# EAGLE design AudioMega DIL-1206 TOP (EAGLE 6.3)
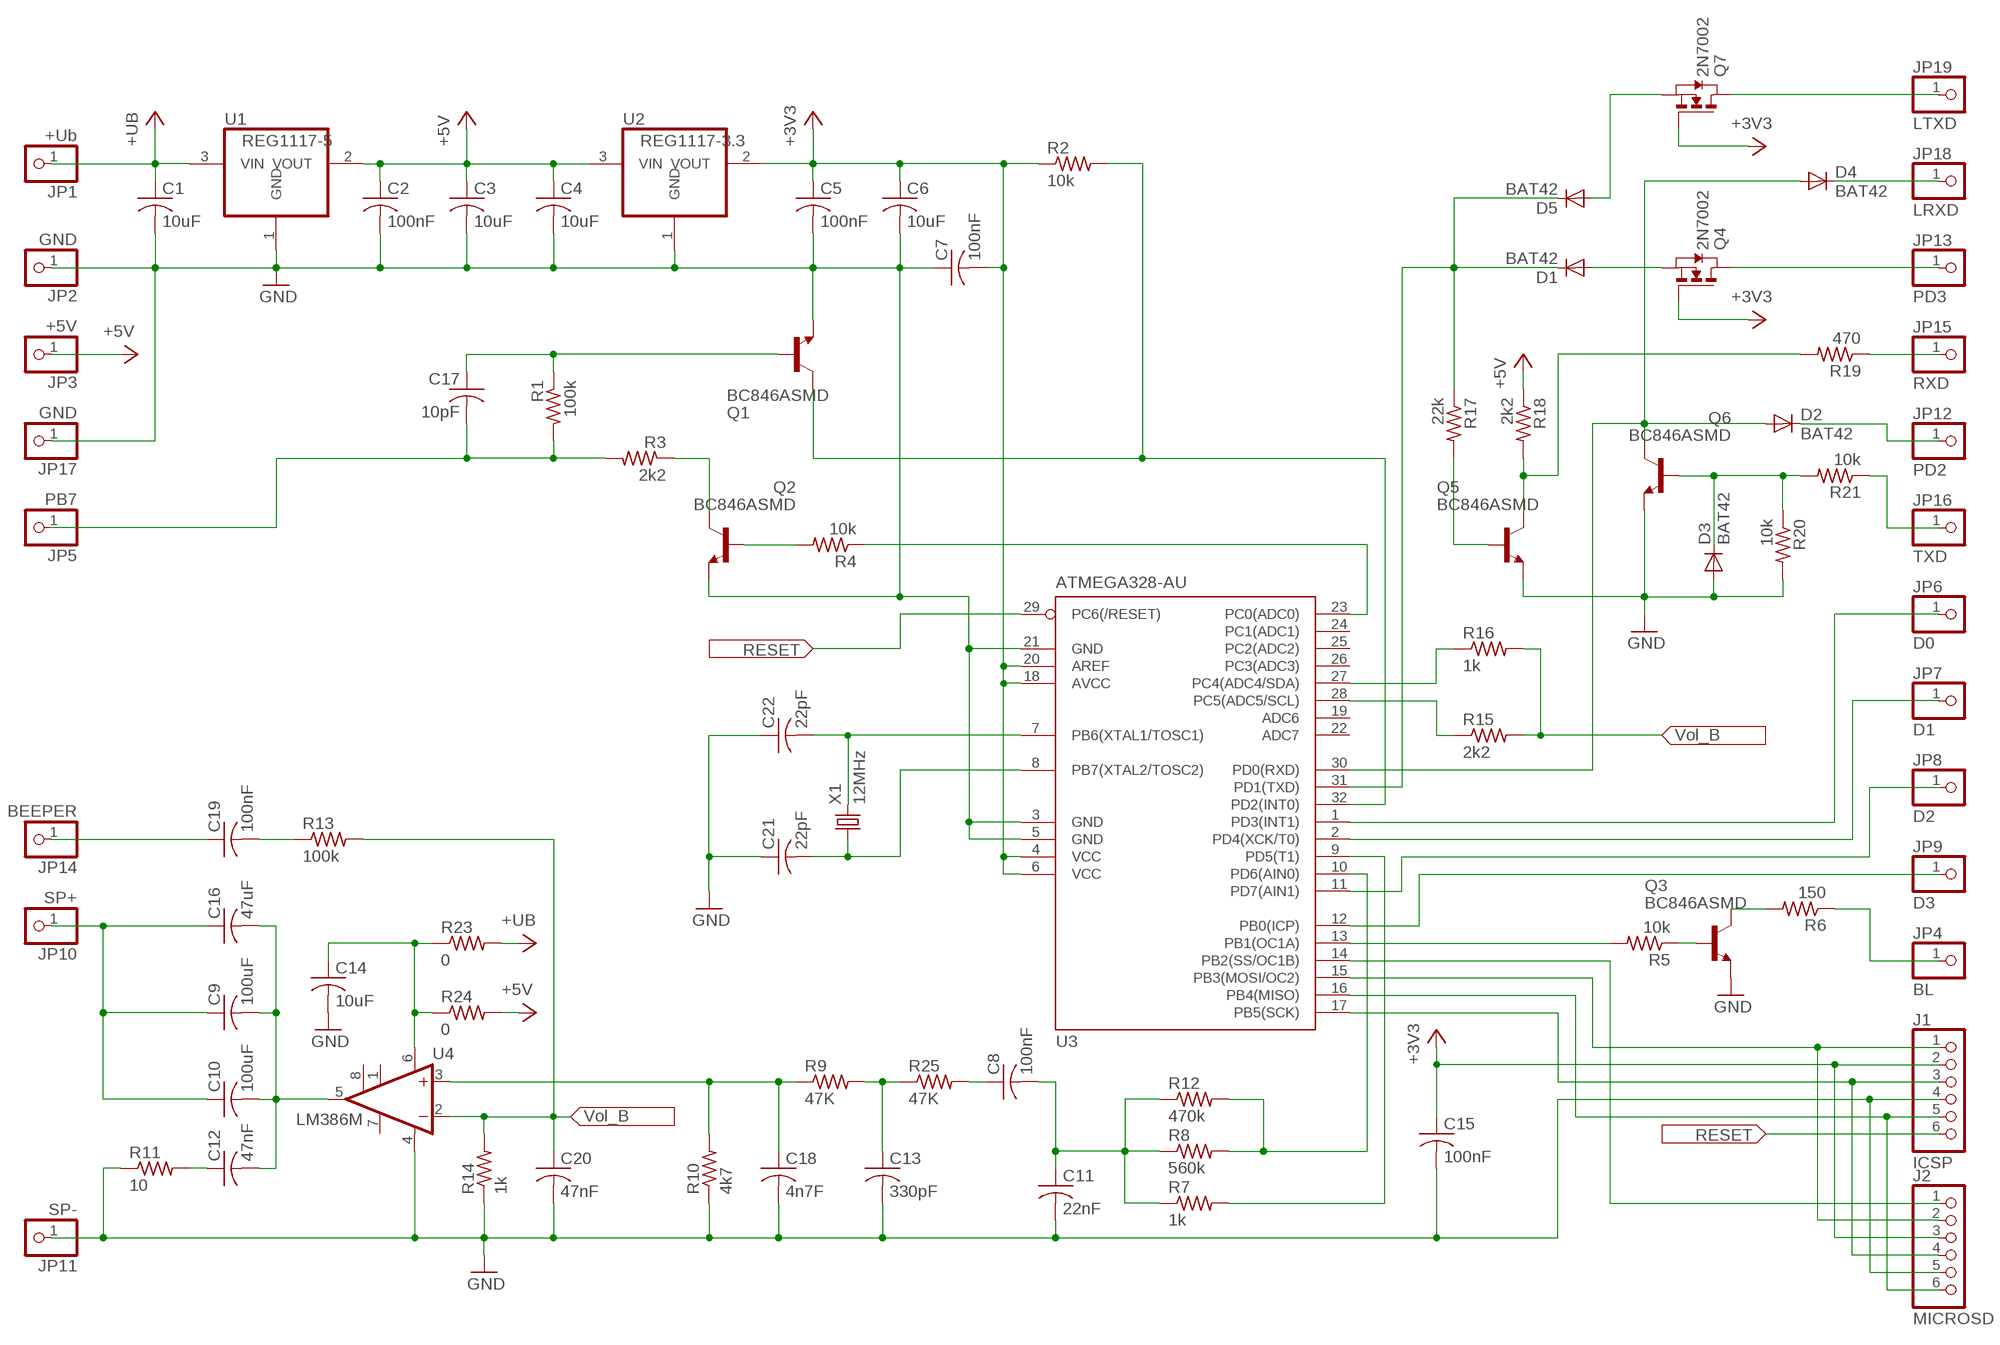
[diagram p0: schematic, sheet 1]

## Parts
C1  10uF  C-USC1206  [C1206]
C2  100nF  C-USC1206  [C1206]
C3  10uF  C-USC1206  [C1206]
C4  10uF  C-USC1206  [C1206]
C5  100nF  C-USC1206  [C1206]
C6  10uF  C-USC1206  [C1206]
C7  100nF  C-USC1206  [C1206]
C8  100nF  C-USC1206  [C1206]
C9  100uF  C-USC1206  [C1206]
C10  100uF  C-USC1206  [C1206]
C11  22nF  C-USC1206  [C1206]
C12  47nF  C-USC1206  [C1206]
C13  330pF  C-USC1206  [C1206]
C14  10uF  C-USC1206  [C1206]
C15  100nF  C-USC1206  [C1206]
C16  47uF  C-USC1206  [C1206]
C17  10pF  C-USC1206  [C1206]
C18  4n7F  C-USC1206  [C1206]
C19  100nF  C-USC1206  [C1206]
C20  47nF  C-USC1206  [C1206]
C21  22pF  C-USC1206  [C1206]
C22  22pF  C-USC1206  [C1206]
D1  BAT42  DIODE-SOD123  [SOD123]
D2  BAT42  DIODE-SOD123  [SOD123]
D3  BAT42  DIODE-SOD123  [SOD123]
D4  BAT42  DIODE-SOD123  [SOD123]
D5  BAT42  DIODE-SOD123  [SOD123]
J1  ICSP  PINHD-1X6  [1X06]
J2  MICROSD  PINHD-1X6  [1X06]
JP1  +Ub  PINHD-1X1  [1X01]
JP2  GND  PINHD-1X1  [1X01]
JP3  +5V  PINHD-1X1  [1X01]
JP4  BL  PINHD-1X1  [1X01]
JP5  PB7  PINHD-1X1  [1X01]
JP6  D0  PINHD-1X1  [1X01]
JP7  D1  PINHD-1X1  [1X01]
JP8  D2  PINHD-1X1  [1X01]
JP9  D3  PINHD-1X1  [1X01]
JP10  SP+  PINHD-1X1  [1X01]
JP11  SP-  PINHD-1X1  [1X01]
JP12  PD2  PINHD-1X1  [1X01]
JP13  PD3  PINHD-1X1  [1X01]
JP14  BEEPER  PINHD-1X1  [1X01]
JP15  RXD  PINHD-1X1  [1X01]
JP16  TXD  PINHD-1X1  [1X01]
JP17  GND  PINHD-1X1  [1X01]
JP18  LRXD  PINHD-1X1  [1X01]
JP19  LTXD  PINHD-1X1  [1X01]
Q1  BC846ASMD  [SOT23]
Q2  BC846ASMD  [SOT23]
Q3  BC846ASMD  [SOT23]
Q4  2N7002  NMOSSOT23  [SOT-23]
Q5  BC846ASMD  [SOT23]
Q6  BC846ASMD  [SOT23]
Q7  2N7002  NMOSSOT23  [SOT-23]
R1  100k  R-US_R1206  [R1206]
R2  10k  R-US_R1206  [R1206]
R3  2k2  R-US_R1206  [R1206]
R4  10k  R-US_R1206  [R1206]
R5  10k  R-US_R1206  [R1206]
R6  150  R-US_R1206  [R1206]
R7  1k  R-US_R1206  [R1206]
R8  560k  R-US_R1206  [R1206]
R9  47K  R-US_R1206  [R1206]
R10  4k7  R-US_R1206  [R1206]
R11  10  R-US_R1206  [R1206]
R12  470k  R-US_R1206  [R1206]
R13  100k  R-US_R1206  [R1206]
R14  1k  R-US_R1206  [R1206]
R15  2k2  R-US_R1206  [R1206]
R16  1k  R-US_R1206  [R1206]
R17  22k  R-US_R1206  [R1206]
R18  2k2  R-US_R1206  [R1206]
R19  470  R-US_R1206  [R1206]
R20  10k  R-US_R1206  [R1206]
R21  10k  R-US_R1206  [R1206]
R23  0  R-US_R1206  [R1206]
R24  0  R-US_R1206  [R1206]
R25  47K  R-US_R1206  [R1206]
U1  REG1117-5  REG1117  [SOT223]
U2  REG1117-3.3  REG1117  [SOT223]
U3  ATMEGA328-AU  MEGA8-AI  [TQFP32-08]
U4  LM386M  LM386M-1  [SO08]
X1  12MHz  CSM-3XHC49/US  [HC49US]

## Nets
+3V3: C5.1 C6.1 C7.2 C15.1 J1.2 J2.3 Q4.3(G) Q7.3(G) R2.1 U2.2(VOUT) U3.4(VCC) U3.6(VCC) U3.18(AVCC) U3.20(AREF)
+5V: C2.1 C3.1 C4.1 JP3.1 R18.1 R24.2 U1.2(VOUT) U2.3(VIN)
+UB: C1.1 JP1.1 R23.2 U1.3(VIN)
B7: C17.2 JP5.1 R1.2 R3.2
BACKLIGHT: JP4.1 R6.1
BEEPER: C19.1 JP14.1
CLK: Q1.3(C) R2.2 U3.32(PD2(INT0))
D0: JP6.1 U3.1(PD3(INT1))
D1: JP7.1 U3.2(PD4(XCK/T0))
D2: JP8.1 U3.11(PD7(AIN1))
D3: JP9.1 U3.12(PB0(ICP))
GND: C1.2 C2.2 C3.2 C4.2 C5.2 C6.2 C7.1 C11.2 C13.2 C14.2 C15.2 C18.2 C20.2 C21.1 C22.1 D3.A J1.4 J2.5 JP2.1 JP11.1 JP17.1 Q1.2(E) Q2.2(E) Q3.2(E) Q5.2(E) Q6.2(E) R10.1 R11.1 R14.1 R20.2 U1.1(GND) U2.1(GND) U3.3(GND) U3.5(GND) U3.21(GND) U4.4(GND)
MISO: J1.5 J2.6 U3.16(PB4(MISO))
MOSI: J1.1 J2.2 U3.15(PB3(MOSI/OC2))
N$1: R4.1 U3.23(PC0(ADC0))
N$2: C8.1 R25.2
N$3: D4.C JP18.1
N$4: JP19.1 Q7.1(D)
N$5: D5.A Q7.2(S)
N$7: C22.2 U3.7(PB6(XTAL1/TOSC1)) X1.2
N$8: C21.2 U3.8(PB7(XTAL2/TOSC2)) X1.1
N$9: Q2.1(B) R4.2
N$10: R16.1 U3.27(PC4(ADC4/SDA))
N$11: R15.1 U3.28(PC5(ADC5/SCL))
N$12: Q2.3(C) R3.1
N$13: C17.1 Q1.1(B) R1.1
N$16: C12.1 R11.2
N$17: C9.2 C10.2 C12.2 C16.2 U4.5(OUT)
N$18: C18.1 R9.1 R10.2 U4.3(+IN)
N$20: C19.2 R13.1
N$21: C14.1 R23.1 R24.1 U4.6(VS)
N$24: C13.1 R9.2 R25.1
N$25: C8.2 C11.1 R7.1 R8.1 R12.1
N$26: Q3.3(C) R6.2
N$27: R7.2 U3.9(PD5(T1))
N$28: R8.2 R12.2 U3.10(PD6(AIN0))
N$33: Q3.1(B) R5.1
N$34: R5.2 U3.13(PB1(OC1A))
N$40: D3.C Q6.1(B) R20.1 R21.2
N$42: D2.A D4.A Q6.3(C) U3.30(PD0(RXD))
N$43: Q5.3(C) R18.2 R19.2
N$44: Q5.1(B) R17.2
N$45: D1.A Q4.2(S)
N$46: D1.C D5.C R17.1 U3.31(PD1(TXD))
PB2: J2.1 U3.14(PB2(SS/OC1B))
PD2: D2.C JP12.1
PD3: JP13.1 Q4.1(D)
RESET: J1.6 U3.29(PC6(/RESET))
RXD: JP15.1 R19.1
SCK: J1.3 J2.4 U3.17(PB5(SCK))
SPEAKER+: C9.1 C10.1 C16.1 JP10.1
TXD: JP16.1 R21.1
VOL_B: C20.1 R13.2 R14.2 R15.2 R16.2 U4.2(-IN)
Unconnected: U3.19(ADC6) U3.22(ADC7) U3.24(PC1(ADC1)) U3.25(PC2(ADC2)) U3.26(PC3(ADC3)) U4.1(GAIN) U4.7(BYPASS) U4.8(GAIN)

## Library data of the parts
C1-C22 = resistor:C-US: CAPACITOR, American symbol
D1-D5 = diode:DIODE-: DIODE
J1 J2 = pinhead:PINHD-1X6: PIN HEADER
JP1-JP19 = pinhead:PINHD-1X1: PIN HEADER
Q1-Q3 Q5 Q6 = transistor-npn:BC846*: NPN Transistor
Q4 Q7 = zetex:NMOSSOT23: MOS FET; OC_FARNELL: unknown; OC_NEWARK: unknown
R1-R21 R25 = resistor:R-US_: RESISTOR, American symbol
R23 R24 = rcl:R-US_: RESISTOR, American symbol
U1 U2 = burr-brown:REG1117: 800mA and 1A Low Dropout (LDO) Positive Regulator 1.8V, 2.5V, 2.85V, 3.3V, 5V, and Adj; MPN: REG1117; OC_FARNELL: 1097566; OC_NEWARK: 14P6981
U3 = atmel:MEGA8: MICROCONTROLLER 8 Kbytes FLASH, 1 kbytes SRAM, 512 bytes EEPROM, USART, 6-channel 10 bit ADC, 2-channel 8 bit ADC Pin compatible with Atmega48, ATMega88, ATMega168 Source: avr.lbr; MPN: ATMEGA8-16AU; OC_FARNELL: 9171371; OC_NEWARK: 73M8863
U4 = linear:LM386?-*: Low Voltage Audio Power Amplifier Source: http://cache.national.com/ds/LM/LM386.pdf
X1 = jdc:CSM-3X

## Board
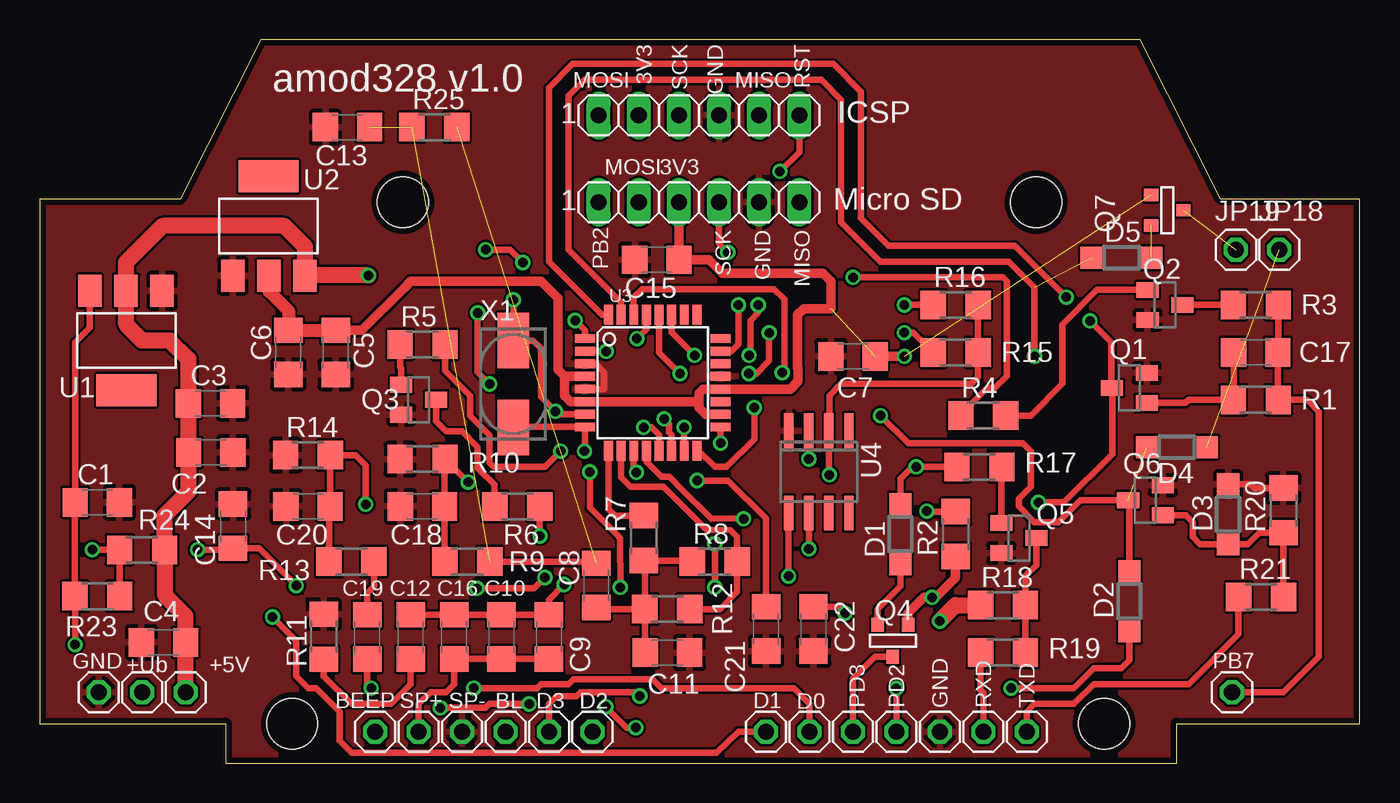
[diagram p1: board, top side]
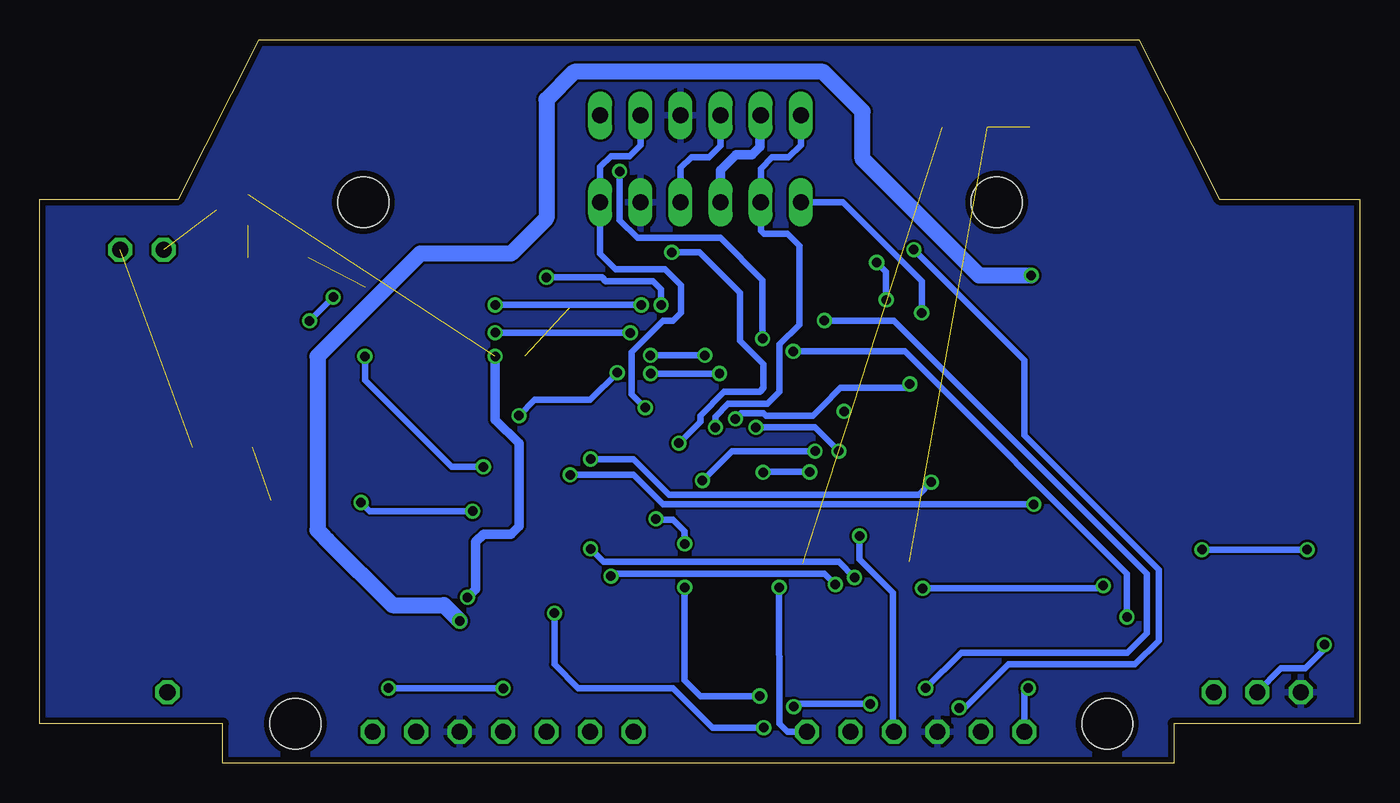
[diagram p2: board, bottom side, seen from below]

Size 83.6 x 45.8 mm. Coordinates in mm from the lower left corner, seen from the top.
Outline: 0,2.5 11.8,2.5 11.8,0 72,0 72,2.5 83.6,2.5 83.6,35.7 74.8,35.7 69.7,45.8 14,45.8 8.9,35.7 0,35.7 0,2.5
Copper layers (1*16): Top 0.0356mm / dielectric 1.5011mm / Bottom 0.0356mm
Design rules "LaenPCBOrder *": minimum track width 6mil, minimum drill 13mil, track to track 6mil, track to pad 6mil, pad to pad 6mil, via to via 6mil, smd to smd 6mil, copper to edge 15mil, drill to drill 6mil, minimum pad ring 7mil, minimum via ring 7mil, stop-mask expansion 4mil, vias tented up to drill 24mil, thermal gap 10mil
Holes 3.2 mm at 16,2.5 67.4,2.5 23,35.5 63.1,35.5

### Footprints (pad centres in the part's own frame; a part is rotated, then mirrored left to right if it is on the bottom)
C1206 = smd 1.6 x 1.8: 1 -1.4,0; 2 1.4,0
SOD123 = smd 1.4 x 1.4: A 1.9,0; C -1.9,0
1X06 = drill 1.016 long: 1 -6.35,0; 2 -3.81,0; 3 -1.27,0; 4 1.27,0; 5 3.81,0; 6 6.35,0
1X01 = drill 1.016 octagon: 1 0,0
SOT23 = smd 1 x 1.4: 1 -0.95,-1.1; 2 0.95,-1.1; 3 0,1.1
SOT-23 = smd 0.787 x 0.889: 1 0.025,-1.016; 2 -0.94,1.016; 3 0.991,1.016
R1206 = smd 1.6 x 1.803: 1 -1.422,0; 2 1.422,0
SOT223 = smd 1.499 x 2.007: 1 -2.261,-3.15; 2 0.025,-3.15; 3 2.311,-3.15 | smd 3.81 x 2.007: 4 0,3.15
TQFP32-08 = smd 1.27 x 0.559: 1 -4.293,2.8; 2 -4.293,2; 3 -4.293,1.2; 4 -4.293,0.4; 5 -4.293,-0.4; 6 -4.293,-1.2; 7 -4.293,-2; 8 -4.293,-2.8; 17 4.293,-2.8; 18 4.293,-2; 19 4.293,-1.2; 20 4.293,-0.4; 21 4.293,0.4; 22 4.293,1.2; 23 4.293,2; 24 4.293,2.8 | smd 0.559 x 1.27: 9 -2.8,-4.293; 10 -2,-4.293; 11 -1.2,-4.293; 12 -0.4,-4.293; 13 0.4,-4.293; 14 1.2,-4.293; 15 2,-4.293; 16 2.8,-4.293; 25 2.8,4.293; 26 2,4.293; 27 1.2,4.293; 28 0.4,4.293; 29 -0.4,4.293; 30 -1.2,4.293; 31 -2,4.293; 32 -2.8,4.293
SO08 = smd 0.6 x 2.2: 1 -1.905,-2.6; 2 -0.635,-2.6; 3 0.635,-2.6; 4 1.905,-2.6; 5 1.905,2.6; 6 0.635,2.6; 7 -0.635,2.6; 8 -1.905,2.6
HC49US = smd 3.5 x 2: 1 -2.75,0; 2 2.75,0

### Placement (x,y rotation side)
C1  3.66,16.51 0 top
C2  10.84,19.67 0 top
C3  10.83,22.77 0 top
C4  7.85,7.65 180 top
C5  18.75,26 270 top
C6  15.75,26 270 top
C7  51.5,25.75 0 top
C8  35.25,11.25 270 top
C9  32.25,8 90 top
C10  29.25,8 90 top
C11  39.75,7 0 top
C12  23.5,8 90 top
C13  19.5,40.25 180 top
C14  12.25,15 90 top
C15  39.09,31.86 180 top
C16  26.25,8 90 top
C17  77,26 0 top
C18  24.25,16.25 180 top
C19  20.75,8 90 top
C20  17,16.25 180 top
C21  46,8.5 90 top
C22  49,8.5 90 top
D1  54.5,14.5 270 top
D2  69,10.25 90 top
D3  75.25,15.75 90 top
D4  72,20 180 top
D5  68.5,32 0 top
J1  41.75,41 0 top
J2  41.75,35.5 0 top
JP1  6.5,4.5 0 top
JP2  3.75,4.5 0 top
JP3  9.25,4.5 0 top
JP4  29.5,2 0 top
JP5  75.5,4.5 0 top
JP6  48.75,2 0 top
JP7  46,2 0 top
JP8  35,2 0 top
JP9  32.25,2 0 top
JP10  24,2 0 top
JP11  26.75,2 0 top
JP12  54.25,2 0 top
JP13  51.5,2 0 top
JP14  21.25,2 0 top
JP15  59.75,2 0 top
JP16  62.5,2 0 top
JP17  57,2 0 top
JP18  78.5,32.5 0 top
JP19  75.75,32.5 0 top
Q1  69,23.75 90 top
Q2  71.25,29 270 top
Q3  24,23 270 top
Q4  54,7.75 0 top
Q5  62,14.25 270 top
Q6  70.02,16.64 90 top
Q7  71.39,34.97 90 top
R1  77,23 0 top
R2  58,14.5 90 top
R3  77,29 0 top
R4  59.75,22 0 top
R5  24.25,26.5 0 top
R6  30.25,16.25 180 top
R7  38.25,14.25 90 top
R8  42.75,12.75 0 top
R9  27.09,12.75 0 top
R10  24.25,19.25 0 top
R11  18,8 270 top
R12  39.75,9.75 0 top
R13  19.75,12.75 180 top
R14  17,19.5 0 top
R15  58,26 0 top
R16  58,29 0 top
R17  59.5,18.75 0 top
R18  61,10 0 top
R19  61,7 0 top
R20  78.75,16 90 top
R21  77.33,10.52 0 top
R23  3.66,10.57 180 top
R24  6.5,13.5 0 top
R25  25,40.25 0 top
U1  5.5,26.75 180 top
U2  14.5,34 0 top
U3  38.82,24.08 0 top
U4  49.34,18.44 180 top
X1  30,24 90 top

### Tracks (layer width: path | path; a pad name or v marks a point on that pad's centre or on a via)
+3V3  (via drill 0.6)  (3 unrouted)
  Top 0.406: 52.92,25.77 C7.2
  Top 0.61: C5.1 20.4,27.4 23.1,30.09 23.51,30.5 31.75,30.5 32.84,29.41 32.84,28.74 32.82,24.91 33.25,24.5 | 33.25,24.5 34.51,24.5 U3.4 | 33.25,24.5 33.25,23.25 33.62,22.88 U3.6 41.62,22.88 41.75,22.75 | 50.06,28.77 48.4,28.77 48,28.37 48,25 48.01,24.99 48.01,24.16 47.53,23.68 U3.20 42,23.67 41.75,23.42 41.75,22.75 | J2.3 C15.1 42.39,31.86 43.25,31 49.6,31 50.1,30.5 50.1,28.77 | Q4.3 54.99,9.49 56,10.5 v56.5,10.5 56.75,10.5 58,11.75 R2.1 | C7.2 v54.75,25.75 | U3.18 42.17,22.08 41.75,22.5 41.75,22.75
  Top 0.813: U2.2 14.53,29.86 15.76,28.63 C6.1 C5.1
  Bottom 0.61: J2.3 40.48,37.52 39.5,38.5 38.5,38.5 38,39 38,40.94 J1.2 | v54.75,25.75 54.75,21.75 53.25,20.25 53.25,15 53.75,14.5 55.5,14.5 56,14 56,11 v56.5,10.5
+5V  (via drill 0.6)
  Top 0.813: 16.83,30.87 U2.3
  Top 1.016: v20.81,30.87 16.83,30.87 | JP3.1 C4.1 9.25,9.31 7.96,10.6 7.96,13.46 R24.2 7.92,15.69 9.45,17.22 C2.1 C3.1 9.43,25.57 8.25,26.75 6.5,26.75 5.5,27.75 5.5,29.87 U1.2 5.47,31.68 7.79,34 15.5,34 16.81,32.69 U2.3 | v57,9 58,10 R18.1
  Bottom 1.016: v20.81,30.87 24.12,30.87 31.5,38.25 31.5,41.25 34,43.75 49.75,43.75 51.5,42 51.5,34.5 53.75,32.25 59.5,32.25 66,25.75 66,14.75 65.75,14.5 65.38,14.12 61.25,10 58,10 v57,9
+UB  (via drill 0.6)
  Top 0.406: v2.25,7.5 2.25,10.56 R23.2 2.24,16.49 C1.1 2.26,26.64 3.17,27.55 3.17,29.88 U1.3
  Bottom 0.406: JP1.1 5,6 3.45,6 2.25,7.2 v2.25,7.5
B7
  Top 0.406: R3.2 78.42,26.02 C17.2 78.4,23.02 R1.2 80.25,23 81,22.25 81,6.75 78.75,4.5 JP5.1
BACKLIGHT  (via drill 0.6)
  Top 0.406: R6.1 v31.67,14.39 v31.68,14.38
  Bottom 0.406: v31.68,14.38 31.68,12.91 29.56,10.79 29.56,2.06 JP4.1
BEEPER  (via drill 0.6)
  Top 0.406: C19.1 20.75,5 v21,4.75
  Bottom 0.406: v21,4.75 21.25,4.5 JP14.1
CLK  (via drill 0.6)
  Top 0.406: R2.2 56.2,15.92 v56.17,15.95 | v63.25,16.5 64.85,16.5 67.91,19.56 Q1.3 67.87,23.78 67.87,26.63 v66.5,28 | U3.32 35.63,28.37 32.25,31.75 32.25,42.75 33.75,44.25 50.25,44.25 52,42.5 52,34.5 53.75,32.75 61.75,32.75 v65,29.5
  Bottom 0.406: v56.17,15.95 62.7,15.95 v63.25,16.5 | v65,29.5 v66.5,28
D0  (via drill 0.6)
  Top 0.406: v27.5,4.75 31.5,4.75 31.75,5 33.5,5 33.81,5.31 38.82,5.31 39.38,4.75 47.75,4.75 48.75,3.75 JP6.1 | U3.1 34.53,27.4 v33.91,28.02
  Bottom 0.406: v27.5,4.75 25.25,7 14.73,7 13.5,8.23 13.5,12 29.5,28 33.89,28 v33.91,28.02
D1  (via drill 0.6)
  Top 0.406: JP7.1 44.25,2 42.87,0.67 19.75,0.67 19,1.42 19,3.25 17.5,4.75 17,4.75 16.25,5.5 16.25,7.75 v14.75,9.25 | v35.88,26.06 35.4,26.08 U3.2
  Bottom 0.406: v14.75,9.25 14.75,12 28.81,26.06 v35.88,26.06
D2  (via drill 0.6)
  Top 0.406: U3.11 37.62,18.58 v37.79,18.41 | v34.84,18.43 34.84,16.16 36.65,14.35 36.65,14.34 36.75,14.24 v36.77,11.13
  Bottom 0.406: v36.77,11.13 36.75,2.5 36.25,2 JP8.1 | v34.84,18.43 37.77,18.43 v37.79,18.41
D3  (via drill 0.6)
  Top 0.406: U3.12 38.42,19.08 39.38,18.12 39.88,18.12 40.75,17.25 42.3,15.73 42.55,15.48 44.54,15.5 v44.58,15.46 | v42.75,13.88 v42.75,11.13 | v38,4.25 37.75,4.5 34.25,4.5 34,4.25 32.75,4.25 32.25,3.75 JP9.1
  Bottom 0.406: v42.75,11.13 42.75,5.25 41.75,4.25 v38,4.25 | v42.75,13.88 42.75,14.69 43.48,15.42 44.54,15.42 v44.58,15.46
GND
  Top 0.406: 12.21,16.44 C14.2 | D3.A 76.7,17.65 76.95,17.4 78.73,17.4 R20.2 | U3.3 35.22,25.28 35.75,24.75 35.75,23.68 U3.5
  pour Top: 0,2.5 0,35.75 9,35.75 14,45.75 69.75,45.75 74.75,35.75 83.6,35.75 83.6,2.5 72,2.5 72,0 11.8,0 11.8,2.5
  pour Bottom: 0,2.5 0,35.7 8.92,35.7 14.01,45.8 69.7,45.8 74.8,35.7 83.6,35.7 83.6,2.5 72.01,2.5 72.01,0 11.8,0 11.8,2.5
MISO  (via drill 0.6)
  Top 0.406: U3.16 41.71,19.79 42.75,18.75 43.5,18.75 45.25,20.5 v45.25,22.5
  Bottom 0.406: J1.5 45.56,39.1 46.24,38.42 47.43,38.42 48.1,37.75 J2.6 48.1,32.23 47.12,31.25 44,31.25 43,30.25 43,28.5 43.5,28 44.12,28 46.11,26.01 46.11,23.36 v45.25,22.5
MOSI  (via drill 0.6)
  Top 0.406: v40.81,21.26 U3.15
  Bottom 0.406: J1.1 35.4,39.11 36.17,38.34 37.22,38.34 37.93,37.63 J2.2 37.93,33.69 37.74,33.5 36.25,33.5 35.5,32.75 35.5,27.75 36.75,26.5 36.75,23.5 37.5,22.75 40,22.75 40.81,21.94 v40.81,21.26
N$1  (via drill 0.6)
  Top 0.406: R4.1 58.33,22.08 60,23.75 60.5,23.75 61.25,24.5 61.25,30.5 61,30.75 v51.5,30.75 | U3.23 43.81,26.08 44.25,26.52 v44.25,29
  Bottom 0.406: v51.5,30.75 48,30.75 47.75,30.5 44.75,30.5 44.25,30 v44.25,29
N$2  (1 unrouted)
N$3  (1 unrouted)
N$4  (1 unrouted)
N$5  (1 unrouted)
N$7  (via drill 0.6)
  Top 0.406: U3.7 34.52,22.07 32.87,22.07 v32.67,22.27 31.75,23.19 31.75,26.25 31.25,26.75 X1.2 v30,29.32 | C22.2 50.6,9.9 v51,9.5 | v31,3.75 28.5,3.75 28.25,3.5 v25.38,3.5 | v37.75,2.25 37.18,2.25 v35.85,3.58 | v28.25,32.5 29.79,32.5 v30.6,31.69
  Bottom 0.406: v51,9.5 51,6.25 49.5,4.75 43.5,4.75 41,2.25 v37.75,2.25 | v31,3.75 v31.01,3.76 35.67,3.76 v35.85,3.58 | v25.38,3.5 25,3.5 22.25,6.25 14.25,6.25 12.75,7.75 12.75,12.25 21.25,20.75 21.25,25.5 v28.25,32.5 | v30,29.32 30,31.09 v30.6,31.69
N$8  (via drill 0.6)
  Top 0.406: X1.1 30.03,21.28 U3.8 34.53,19.78 v34.5,19.75 | C21.2 46,15.5 43.6,17.86 v41.63,17.89
  Bottom 0.406: v41.63,17.89 39.75,19.75 v34.5,19.75
N$9
  Top 0.406: Q2.1 66.95,29.95 64.75,27.75 64.75,24 62.75,22 R4.2
N$10  (via drill 0.6)
  Top 0.406: R16.1 v54.75,29 | U3.27 40.02,27.26 v41.47,25.81 | v45.5,29 45.5,28.5 45,28 45,25.89 v44.92,25.81
  Bottom 0.406: v54.75,29 v45.5,29 | v41.47,25.81 v44.92,25.81
N$11  (via drill 0.6)
  Top 0.406: R15.1 55.33,27.25 v54.75,27.25 | U3.28 39.22,25.99 v40.55,24.66 | v44.91,24.66 45.38,24.66 46.19,25.47 v46.19,27.23 v46.2,27.24
  Bottom 0.406: v54.75,27.25 v54.74,27.24 v46.2,27.24 | v40.55,24.66 v44.91,24.66
N$12
  Top 0.406: Q2.3 R3.1
N$13
  Top 0.406: C17.1 75.6,23.02 R1.1 72.75,23 72.55,22.8 Q1.1
N$16
  Top 0.406: C12.1 23.5,5 22.25,3.75 19.75,3.75 18,5.5 R11.2
N$17  (via drill 0.6)
  Top 0.406: C12.2 C16.2 C10.2 C9.2 32.25,10.34 v33.22,11.31 | v47.42,11.84 47.42,15.82 U4.5
  Bottom 0.406: v33.22,11.31 33.91,12 47.26,12 v47.42,11.84
N$18  (via drill 0.6)
  Top 0.406: v27.15,17.79 27.13,17.79 R10.2 25.65,19.23 C18.1 25.65,12.77 R9.1 | v48.71,19.25 v48.7,19.25 U4.3
  Bottom 0.406: v27.15,17.79 27.94,17 43.75,17 46,19.25 v48.71,19.25
N$20
  Top 0.406: C19.2 20.75,10.77 21.18,11.2 R13.1
N$21  (via drill 0.6)
  Top 0.406: R23.1 R24.1 | R24.1 | R24.1 3.35,13.5 v3.34,13.51 | v10.01,13.51 12.16,13.51 C14.1 13.9,13.6 v16.25,11.25 v16.25,11.24 | v27.69,11.07 31.32,11.07 v32,11.75 | v48.71,13.57 U4.6
  Bottom 0.406: v3.34,13.51 v10.01,13.51 | v16.25,11.24 16.42,11.07 v27.69,11.07 | v32,11.75 33,12.75 47.89,12.75 v48.71,13.57
N$24  (2 unrouted)
  Top 0.406: R9.2 35.15,12.75
N$25
  Top 0.406: C11.1 38.35,9.73 R12.1 | R12.1 35.35,9.75 C8.2 | R12.1 38.33,12.75 R7.1 41.25,12.83 R8.1
N$26
  Top 0.406: Q3.3 25.1,21.65 25.75,21 26.75,21 27.75,20 27.75,18.68 28.82,17.61 R6.2
N$27
  Top 0.406: R7.2 36.43,15.67 36.03,16.07 36.03,19.78 U3.9
N$28
  Top 0.406: R12.2 43.07,9.75 44.16,10.84 44.16,12.74 R8.2 44.17,14.33 43.75,14.75 42.23,14.77 39.5,17.5 37.43,17.5 36.83,18.1 36.83,19.78 U3.10
N$33
  Top 0.406: Q3.1 22.9,24.99 22.83,25.06 R5.1
N$34  (via drill 0.6)
  Top 0.406: R5.2 25.67,24.83 27.25,23.25 27.25,22 28.5,20.75 28.5,19 28.75,18.75 32,18.75 v33,19.75 | U3.13 39.22,20.78 38.75,21.25 v38.25,21.25
  Bottom 0.406: v33,19.75 34.5,21.25 v38.25,21.25
N$40
  Top 0.406: R21.2 R20.1 77.23,14.57 76.51,13.85 D3.C 73.46,13.86 73,14.32 73,15.25 72.56,15.69 Q6.1
N$42  (via drill 0.6)  (1 unrouted)
  Top 0.406: D2.A 69,16.56 Q6.3 65.89,16.64 64.5,15.25 63,15.25 62,16.25 62,16.75 62.75,17.5 62.75,19.75 62.25,20.25 55,20.25 v53.25,22 | U3.30 37.61,28.38 37.61,29.48 38.13,30 46.5,30 47.15,29.35 47.15,24.85 v47.02,24.72
  Bottom 0.406: v53.25,22 52.25,23 48.74,23 v47.02,24.72
N$43
  Top 0.406: R19.2 R18.2 62.42,11.85 63.1,12.53 Q5.3
N$44
  Top 0.406: Q5.1 60.9,18.73 R17.2
N$45
  Top 0.406: Q4.2 53.06,9.74 54.51,11.19 D1.A
N$46  (via drill 0.6)  (1 unrouted)
  Top 0.406: D1.C 54.49,17.99 55.25,18.75 v55.5,18.75 R17.1 | U3.31 36.82,29.18 33.5,32.5 33.5,42.25 34.5,43.25 49.5,43.25 50.75,42 50.75,34.25 53.25,31.75 61.37,31.75 62.99,30.13 v62.99,25.76 v63,25.75
  Bottom 0.406: v63,25.75 63,24.25 57.5,18.75 v55.5,18.75
PB2  (via drill 0.6)
  Top 0.406: v28.5,24 27.75,24.75 v27.75,28.5 | U3.14 40.02,20.78 39.85,20.95 39.85,21.48 v39.54,21.79
  Bottom 0.406: v28.5,24 28.75,23.75 32.89,23.75 34.07,22.57 34.36,22.28 34.64,22 37.62,22 37.76,22.14 39.19,22.14 v39.54,21.79 | v27.75,28.5 27.75,30.5 32.75,35.5 J2.1
PD2  (via drill 0.6)
  Top 0.406: D2.C 69,6.5 68.5,6 66.75,6 65.5,4.75 v61.5,4.75 | v54.25,4.74 JP12.1
  Bottom 0.406: v61.5,4.75 v54.26,4.75 v54.25,4.74
PD3
  Top 0.406: JP13.1 51.5,5.33 52.9,6.73 Q4.1
RESET  (via drill 0.6)
  Top 0.406: v46.87,37.45 48.1,38.68 J1.6 | U3.29 38.42,27.47 v37.82,26.87
  Bottom 0.406: v46.87,37.45 46.87,34.37 45.75,33.25 40.5,33.25 37.82,30.57 v37.82,26.87
RXD
  Top 0.406: JP15.1 59.75,4.45 59.58,4.62 R19.1
SCK  (via drill 0.6)
  Top 0.406: J2.4 43.02,32.88 v43.57,32.33 | v43.12,20.25 U3.17
  Bottom 0.406: J1.3 40.48,39.09 41.21,38.36 42.33,38.36 43.02,37.67 J2.4 | v43.12,20.25 41.75,21.62 41.75,22 40.25,23.5 38,23.5 37.75,23.75 37.75,25.25 39.25,26.75 39.25,29.77 41.81,32.33 v43.57,32.33
SPEAKER+
  Top 0.406: C9.1 C10.1 C16.1 26.25,5 25.75,4.5 24.75,4.5 24,3.75 JP10.1
TXD
  Top 0.406: JP16.1 62.5,3.25 63,3.75 65.5,3.75 66.75,5 72.75,5 75.91,8.16 R21.1
VOL_B  (via drill 0.6)
  Top 0.406: R16.2 R15.2 59.42,24.42 59,24 50.75,24 50,23.25 50,21.07 U4.2 | R13.2 18.33,16.18 C20.1 18.4,19.48 R14.2 20,19.5 20.65,18.85 v20.65,16.38 | 50,21.02 U4.2 | v50,18.25 49.98,18.27 U4.2
  Bottom 0.406: v20.65,16.38 44.13,16.38 46,18.25 v50,18.25

### Text on the board
tNames: 3V3 | SCK | GND | RST | MOSI | MISO | amod328 v1.0 | 1 | ICSP | MOSI | 3V3 | 1 | Micro SD | SCK | GND | MISO | PB2 | GND | +Ub | +5V | PB7 | BEEP | SP+ | SP- | BL | D3 | D2 | D1 | D0 | PD3 | PD2 | GND | RXD | TXD